# Altium schematic sheet DCF-ECU.SchDoc
size A3; SheetNumber: 1; SheetTotal: 1
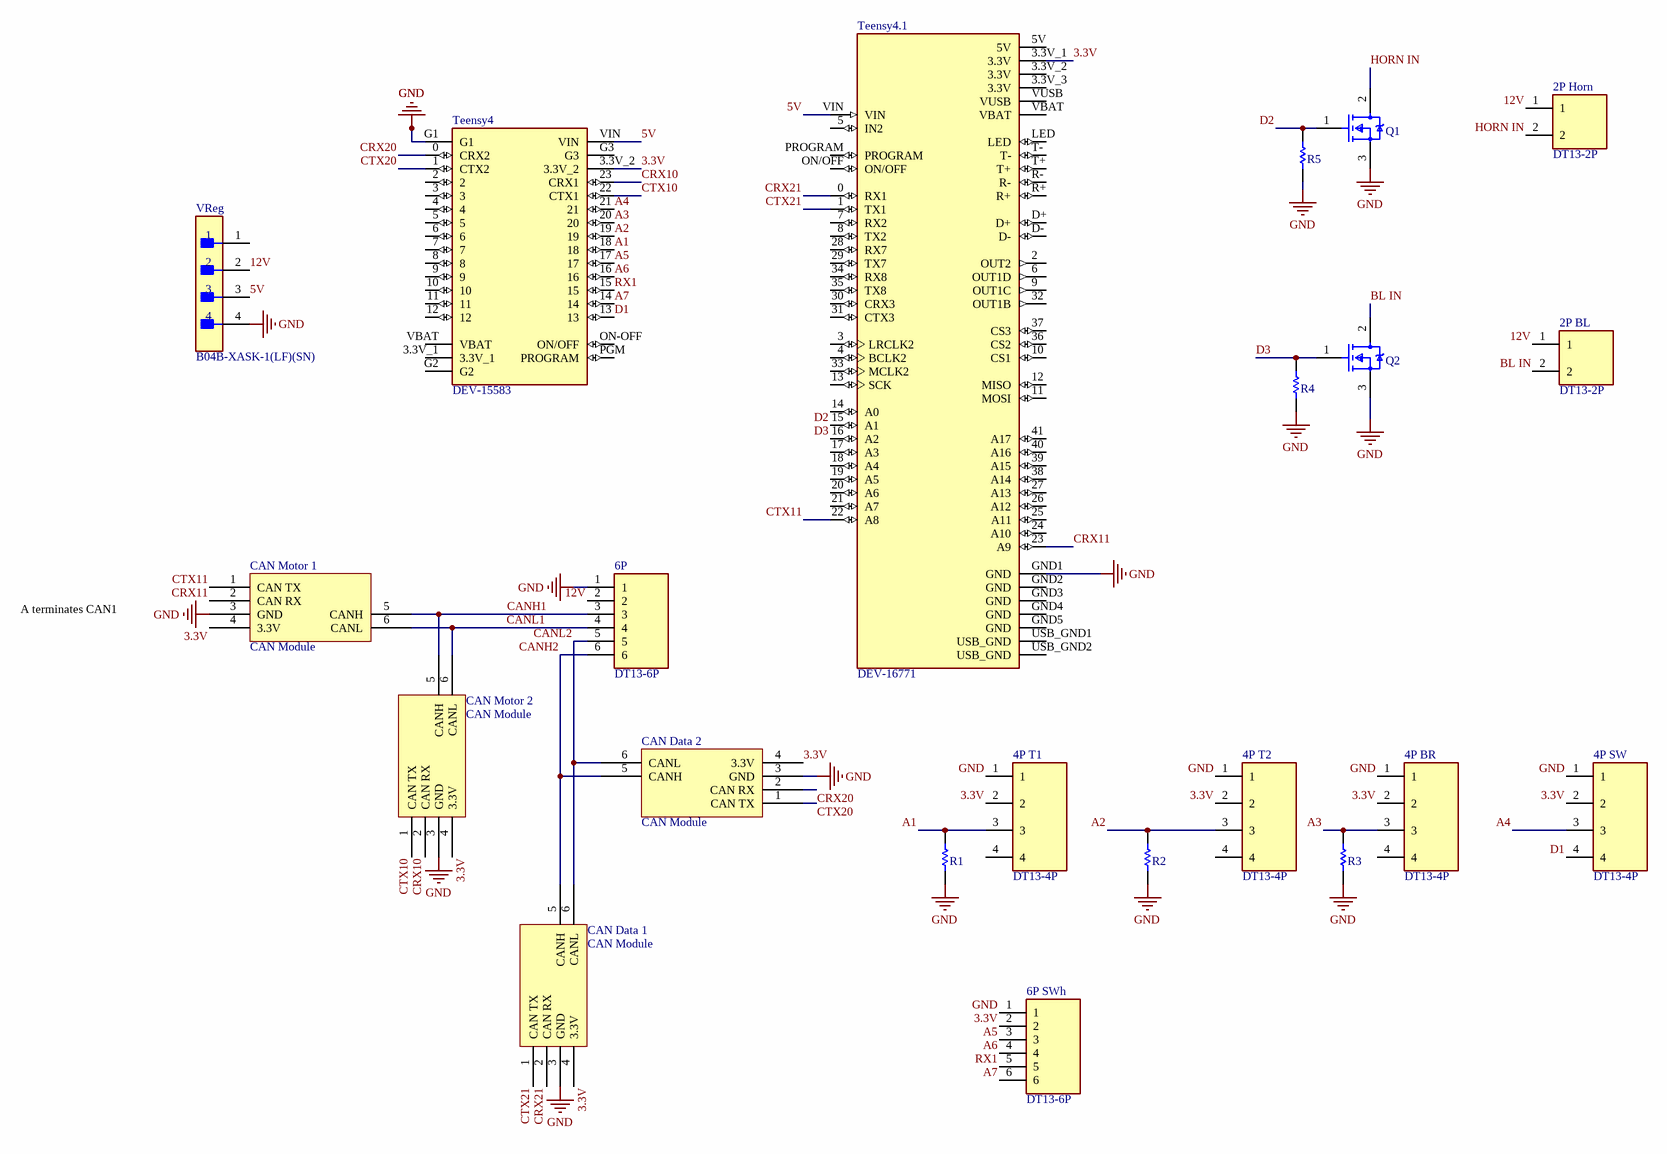
[diagram p0: DCF-ECU.SchDoc]

## Parts
2P_BL  DT13-2P  [TE_DT13-2P]
2P_Horn  DT13-2P  [TE_DT13-2P]
4P_BR  DT13-4P  [TE_DT13-4P]
4P_SW  DT13-4P  [TE_DT13-4P]
4P_T1  DT13-4P  [TE_DT13-4P]
4P_T2  DT13-4P  [TE_DT13-4P]
6P  DT13-6P  [TE_DT13-6P]
6P_SWh  DT13-6P  [TE_DT13-6P]
CAN_Data_1  CAN Module  [CAN Module-Footprint-1]
CAN_Data_2  CAN Module  [CAN Module-Footprint-1]
CAN_Motor_1  CAN Module  [CAN Module-Footprint-1]
CAN_Motor_2  CAN Module  [CAN Module-Footprint-1]
Q1  IRLZ44NPbF  [FP-PG-TO220-3-MFG]  (value not drawn)
Q2  IRLZ44NPbF  [FP-PG-TO220-3-MFG]  (value not drawn)
R1  MFR-25FBF5210K  [RESA60-630X240]  (value not drawn)
R2  MFR-25FBF5210K  [RESA60-630X240]  (value not drawn)
R3  MFR-25FBF5210K  [RESA60-630X240]  (value not drawn)
R4  MFR-25FBF5210K  [RESA60-630X240]  (value not drawn)
R5  MFR-25FBF5210K  [RESA60-630X240]  (value not drawn)
Teensy4  DEV-15583  [MODULE_DEV-15583]
Teensy4.1  DEV-16771  [MODULE_DEV-16771]
VReg  B04B-XASK-1(LF)(SN)  [FP-B04B-XASK-1_LF_SN-MFG]

## Nets
GND: 4P_BR.1 4P_SW.1 4P_T1.1 4P_T2.1 6P.1 6P_SWh.1 CAN_Data_1.3(GND) CAN_Data_2.3(GND) CAN_Motor_1.3(GND) CAN_Motor_2.3(GND) Q1.3(S) Q2.3(S) R1.1 R2.1 R3.1 R4.1 R5.1 Teensy4.G1 Teensy4.1.GND1(GND) VReg.4
3.3V: 4P_BR.2 4P_SW.2 4P_T1.2 4P_T2.2 6P_SWh.2 CAN_Data_1.4(3.3V) CAN_Data_2.4(3.3V) CAN_Motor_1.4(3.3V) CAN_Motor_2.4(3.3V) Teensy4.3.3V_2 Teensy4.1.3.3V_1(3.3V)
5V: Teensy4.VIN Teensy4.1.VIN VReg.3
12V: 2P_BL.1 2P_Horn.1 6P.2 VReg.2
A1: 4P_T1.3 R1.2 Teensy4.18
A2: 4P_T2.3 R2.2 Teensy4.19
A3: 4P_BR.3 R3.2 Teensy4.20
A4: 4P_SW.3 Teensy4.21
A5: 6P_SWh.3 Teensy4.17
A6: 6P_SWh.4 Teensy4.16
A7: 6P_SWh.6 Teensy4.14
BL IN: 2P_BL.2 Q2.2(D)
CANH1: 6P.3 CAN_Motor_1.5(CANH) CAN_Motor_2.5(CANH)
CANH2: 6P.6 CAN_Data_1.5(CANH) CAN_Data_2.5(CANH)
CANL1: 6P.4 CAN_Motor_1.6(CANL) CAN_Motor_2.6(CANL)
CANL2: 6P.5 CAN_Data_1.6(CANL) CAN_Data_2.6(CANL)
CRX10: CAN_Motor_2.2(CAN_RX) Teensy4.23(CRX1)
CRX11: CAN_Motor_1.2(CAN_RX) Teensy4.1.23(A9)
CRX20: CAN_Data_2.2(CAN_RX) Teensy4.0(CRX2)
CRX21: CAN_Data_1.2(CAN_RX) Teensy4.1.0(RX1)
CTX10: CAN_Motor_2.1(CAN_TX) Teensy4.22(CTX1)
CTX11: CAN_Motor_1.1(CAN_TX) Teensy4.1.22(A8)
CTX20: CAN_Data_2.1(CAN_TX) Teensy4.1(CTX2)
CTX21: CAN_Data_1.1(CAN_TX) Teensy4.1.1(TX1)
D1: 4P_SW.4 Teensy4.13
D2: Q1.1(G) R5.2 Teensy4.1.15(A1)
D3: Q2.1(G) R4.2 Teensy4.1.16(A2)
HORN IN: 2P_Horn.2 Q1.2(D)
RX1: 6P_SWh.5 Teensy4.15

Not connected (* = marked no-connect by the designer): 4P_BR 4; 4P_T1 4; 4P_T2 4; Teensy4 2 3 3.3V_1 4 5 6 7 8 9 10 11 12 G2 G3 ON-OFF(ON/OFF) PGM(PROGRAM) VBAT; Teensy4.1 2(OUT2) 3(LRCLK2) 3.3V_2(3.3V) 3.3V_3(3.3V) 4(BCLK2) 5(IN2) 5V 6(OUT1D) 7(RX2) 8(TX2) 9(OUT1C) 10(CS1) 11(MOSI) 12(MISO) 13(SCK) 14(A0) 17(A3) 18(A4) 19(A5) 20(A6) 21(A7) 24(A10) 25(A11) 26(A12) 27(A13) 28(RX7) 29(TX7) 30(CRX3) 31(CTX3) 32(OUT1B) 33(MCLK2) 34(RX8) 35(TX8) 36(CS2) 37(CS3) 38(A14) 39(A15) 40(A16) 41(A17) D+ D- GND2(GND) GND3(GND) GND4(GND) GND5(GND) LED ON/OFF PROGRAM R+ R- T+ T- USB_GND1(USB_GND) USB_GND2(USB_GND) VBAT VUSB; VReg 1

## Notes on the sheet
- A terminates CAN1

## Library data of the parts
2P_BL 2P_Horn = DT13-2P: DT13 Series, 5.46mm Pitch 2 Way 1 Row Right Angle PCB Header, Solder Termination; MF: TE Connectivity; Value: *; Price: None; Package: None; Availability: Unavailable; SnapEDA_Link: https://www.snapeda.com/parts/DT13-2P/TE%20Connectivity%20Deutsch%20Connectors/view-part/1788306/?ref=snap; EU_RoHS_Compliance: Compliant; DigiKey-Purchase-URL: https://snapeda.com/shop?store=DigiKey&id=1788306; MP: DT13-2P
4P_BR 4P_SW 4P_T1 4P_T2 = DT13-4P: DT13 Series, 4.44mm Pitch 4 Way 2 Row Right Angle PCB Header, Solder Termination; MF: TE Connectivity; SnapEDA_Link: https://www.snapeda.com/parts/DT13-4P/TE%20Connectivity%20Deutsch%20Connectors/view-part/2708791/?ref=snap; MP: DT13-4P; TE_purchase_URL: https://www.te.com/usa-en/product-DT13-4P.html?te_bu=Cor&te_type=disp&te_campaign=seda_glo_cor-seda-global-disp-prtnr-fy19-seda-model-bom-cta_sma-317_1&elqCampaignId=32493; Availability: Unavailable; Value: *; Price: None; Package: None
6P 6P_SWh = DT13-6P: DT13 Series, 4.44mm Pitch 6 Way 2 Row Right Angle PCB Header, Solder Termination; MF: TE Connectivity; DigiKey-Purchase-URL: https://snapeda.com/shop?store=DigiKey&id=1897474; Value: *; SnapEDA_Link: https://www.snapeda.com/parts/DT13-6P/TE%20Connectivity%20Deutsch%20Connectors/view-part/1897474/?ref=snap; EU_RoHS_Compliance: Compliant; Availability: Unavailable; Price: None; Package: None; MP: DT13-6P
CAN_Data_1 CAN_Data_2 CAN_Motor_1 CAN_Motor_2 = CMP-00030-00003-1: CAN waveshare
Q1 Q2 = CMP-32901-000488-1: MOSFET N-CH 55V 47A TO220AB; Turn-On Delay Time: 11ns; Gate to Source Voltage (Vgs): 16V; Element Configuration: Single; Rds On Max: 22mR; Turn-Off Delay Time: 26ns; Max Power Dissipation: 110W; Threshold Voltage: 2V; Drain to Source Resistance: 35mR; Input Capacitance: 1.7nF; Continuous Drain Current (ID): 47A; Case/Package: TO-220; Lead Free: Lead Free; Halogen Free: Halogen Free; Packaging: Rail/Tube; Length: 0.414inch; Min Operating Temperature: -55°C; REACH SVHC: No SVHC; Number of Pins: 3; Width: 0.185inch; Drain to Source Voltage (Vdss): 55V; Power Dissipation: 110W; RoHS Compliant: Yes; Max Operating Temperature: 175°C; Height: 0.6inch; Max Dual Supply Voltage: 55V; Drain to Source Breakdown Voltage: 55V; Mount: Through Hole
R1-R5 = CMP-1659-00074-2: Axial Resistor, 10 KOhm, +/- 1%, 0.25 W, -55 to 155 degC, 2-Pin THD, RoHS, Bulk; Manufacturer: Yageo; Temperature Coefficient: 100ppm\/degreesC; Voltage Rating: 250V; Voltage Rating (DC): 200V; Resistance: 10KOhm; Max Power Dissipation: 250mW; Datasheet URL: http://www.yageo.com/documents/recent/Yageo%20LR_MFR_2013.pdf; Packaging: Bulk; RoHSCompliant: True; Mount: ThroughHole; Package Reference: MFR-25; Termination: Axial; Composition: MetalFilm; Number of Terminations: 2; Package Quantity: 200; Mounting Technology: ThroughHole; Length: 0.248inch; Max Operating Temperature: 155degC; Min Operating Temperature: -55degC; Datasheet Version: 04/2013; Lead Free: LeadFree; Manufacturer URL: http://www.yageo.com/; Tolerance: 1%; Power Rating: 250mW; Package Description: 2-Pin Axial Lead, Dia 2.4 mm, Body Length 6.3 mm; Military Standard: Not; Case\/Package: Axial
Teensy4 = DEV-15583: RT1062 Teensy 4.0 i.MX ARMÂ® CortexÂ®-M7 MPU Embedded Evaluation Board; MF: SparkFun Electronics; Value: *; Package: None; Digi-Key_Part_Number: 1568-DEV-15583-ND; Digi-Key_Purchase_URL: https://www.digikey.com/product-detail/en/sparkfun-electronics/DEV-15583/1568-DEV-15583-ND/10384551?utm_source=snapeda&utm_medium=aggregator&utm_campaign=symbol; MP: DEV-15583; SnapEDA_Link: https://www.snapeda.com/parts/DEV-15583/SparkFun%20Electronics/view-part/4001229/?ref=snap
Teensy4.1 = DEV-16771: RT1062 Teensy 4.1 series ARM® Cortex®-M7 MPU Embedded Evaluation Board; MF: SparkFun Electronics; SnapEDA_Link: https://www.snapeda.com/parts/DEV-16771/SparkFun+Electronics/view-part/?ref=snap; Package: None; Value: *; MP: DEV-16771; Check_prices: https://www.snapeda.com/parts/DEV-16771/SparkFun+Electronics/view-part/?ref=eda
VReg = CMP-17439-000018-1: CONN HEADER VERT 4POS 2.5MM; Manufacturer: JST; Current Rating: 3A; Voltage Rating: 250V; Conn Orientation: Straight; Conn Gender: Male; Number Of Contacts: 4; ComponentLink2Description: Datasheet; Package: B04B-XASK-1(LF)(SN); Octopart: https://octopart.com/b04b-xask-1%28lf%29%28sn%29-jst-3990149; Pitch: 2.5mm; Device Class L1: Connectors; RoHS: TRUE; Device Class L3: unset; Manufacturer Part Number: B04B-XASK-1(LF)(SN); Temperature Range High: +85°C; Height: 8.8mm; Lead Free: Yes; Category: Conn; Temperature: -25°C to +85°C; Digikey Description: CONN HEADER VERT 4POS 2.5MM; Temperature Range Low: -25°C; ComponentLink2URL: http://www.jst-mfg.com/product/pdf/eng/eXA1.pdf; Contact Material: Tin,Copper; Device Class L2: Headers and Wire Housings; Automotive: No; Number Of Rows: 1